# Altium schematic sheet PWR_REVX.SchDoc
size A4; SheetNumber: 1; SheetTotal: 1
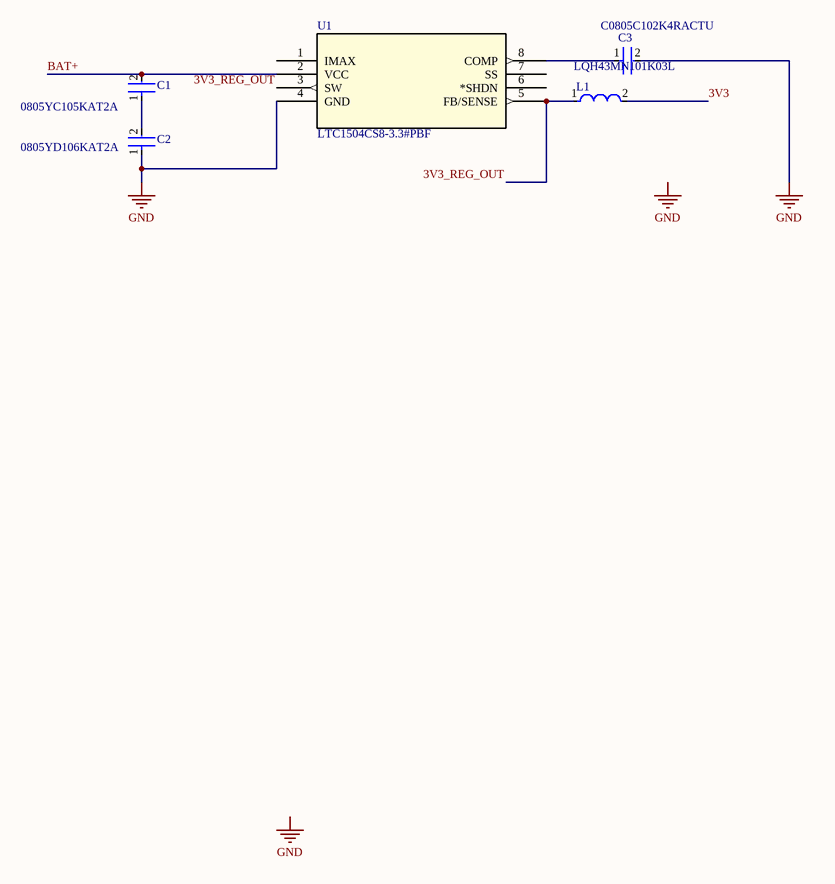
[diagram p0: PWR_REVX.SchDoc]

## Parts
C1  0805YC105KAT2A  [FP-0805-L_2_01_0_2-W_1_25-IPC_A]
C2  0805YD106KAT2A  [FP-0805-L_2_01_0_2-W_1_25-IPC_A]
C3  C0805C102K4RACTU  [FP-C0805C-DN-MFG]
L1  LQH43MN101K03L  [FP-LQH43CN_03-MFG]
U1  LTC1504CS8-3.3#PBF  [SO-8_S_LIT]

## Nets
GND: C2.1 C3.2 U1.4(GND)
3V3: L1.2
3V3_REG_OUT: L1.1 U1.3(SW) U1.5(FB/SENSE)
BAT+: C1.2 U1.2(VCC)
NetC1_1: C1.1 C2.2
NetC3_1: C3.1 U1.8(COMP)

Not connected (* = marked no-connect by the designer): U1 1(IMAX) 6(*SHDN) 7(SS)

## Notes on the sheet
- Labels drawn without touching a wire or pin: GND

## Library data of the parts
C1 = CMP-2007-04655-2: General Purpose Ceramic Capacitor, 0805, 1uF, 10%, X7R, 15%, 16V; Dissipation Factor: 3.5%; Case/Package: 0805; Dielectric Material: Ceramic; Number of Pins: 2; Length: 2.01mm; Tolerance: 10%; Capacitance: 1uF; Depth: 1.25mm; Termination: SMD/SMT; Height: 1.4mm; Packaging: Tape and Reel; Max Operating Temperature: 125°C; Case Code (Imperial): 0805; Lead Free: Lead Free; Package Quantity: 1; Construction: Flat; Voltage Rating (DC): 16V; Radiation Hardening: No; Contact Plating: Tin; Thickness: 0.055inch; Dielectric: X7R; Width: 0.049inch; Voltage: 16V; Voltage Rating: 16V; Mount: Surface Mount; Series: -; Min Operating Temperature: -55°C; REACH SVHC: No SVHC; RoHS Compliant: Yes; Case Code (Metric): 2012
C2 = CMP-1036-04927-3: General Purpose Ceramic Capacitor, 0805, 10uF, 10%, X5R, 15%, 16V; Construction: Flat; Height: 1.4mm; Width: 0.049inch; Contact Plating: Tin; RoHS Compliant: Yes; Min Operating Temperature: -55°C; Depth: 1.25mm; Series: -; Voltage Rating: 16V; Termination: SMD/SMT; Case Code (Metric): 2012; Voltage Rating (DC): 16V; Voltage: 16V; Length: 2.01mm; Thickness: 0.055inch; Radiation Hardening: No; Mount: Surface Mount; Dielectric: X5R; Lead Free: Lead Free; Dielectric Material: Ceramic; Capacitance: 10uF; Case/Package: 0805; REACH SVHC: No SVHC; Packaging: Tape and Reel; Max Operating Temperature: 85°C; Package Quantity: 1; Case Code (Imperial): 0805; Number of Pins: 2; Tolerance: 10%
C3 = CMP-2007-00242-2: CAP CER 1000PF 16V 10% X7R 0805; Manufacturer: KEMET; Capacitance: 1,000 pF; Description: C0805 1,000 pF X7R 30ppm/°C 10.00% 16 V; Temperature Coefficient: 30ppm/°C; Tolerance: 0.1; Material: Ceramic; Value: 1,000 pF; ComponentLink2URL: https://content.kemet.com/datasheets/KEM_C1003_C0G_SMD.pdf; Digikey Description: CAP CER 1000PF 16V 10% X7R 0805; Manufacturer Part Number: C0805C102K4RACTU; Voltage Rating: 16 V; Temperature Range High: +125°C; Category: Cap; Temperature Characteristic: X7R; Device Class L2: Capacitors; Octopart: https://octopart.com/c0805c102k4ractu-kemet-8375752; Package: C0805C-DN; Automotive: No; Device Class L1: Passive Components; Ipc Land Pattern Name: CAPC200125X78; Lead Free: Yes; RoHS: TRUE; Mouser Description: Multilayer Ceramic Capacitors MLCC - SMD/SMT 16volts 1000pF X7R 10%; Height: 0.88mm; Temperature Range Low: -55°C; ComponentLink2Description: Datasheet; Temperature: -55°C to +125°C; Device Class L3: Ceramic Capacitors
L1 = CMP-06042-012064-1: Wire Wound Ferrite Inductor for General Circuits 100μH ±10% 2.5Ω 160mA 1812; Shielding: Unshielded; DC Resistance (DCR): 2.5R; Current: 40mA; Test Frequency: 1MHz; Self Resonant Frequency: 6.8MHz; Q Factor: 40; Inductance: 100uH; Core Material: Ferrite; Length: 4.5mm; Packaging: Tape and Reel; Max DC Current: 160mA; Package Quantity: 500; Current Rating: 160mA; Depth: 3.4mm; Inductance Tolerance: 10%; Series Resistance: 2.5R; Tolerance: 10%; Termination: SMD/SMT; Width: 3.2mm; Min Operating Temperature: -25°C; Max Operating Temperature: 85°C; Height: 2.6mm; Military Standard: Not; Weight: 0.004586oz; Frequency: 6.8MHz; REACH SVHC: No SVHC; Case/Package: 1812; DC Current: 160mA; Case Code (Imperial): 1812; Mount: Surface Mount; Case Code (Metric): 4532; Lead Free: Lead Free; Radiation Hardening: No
U1 = LTC1504CS8-3.3#PBF: No Description Available; Mfr_Name: Analog Devices Inc; Copyright: Copyright (C) 2022 Ultra Librarian. All rights reserved.; Manufacturer_Part_Number: LTC1504CS8-3.3#PBF; RefDes: RefDes; Type: DEV